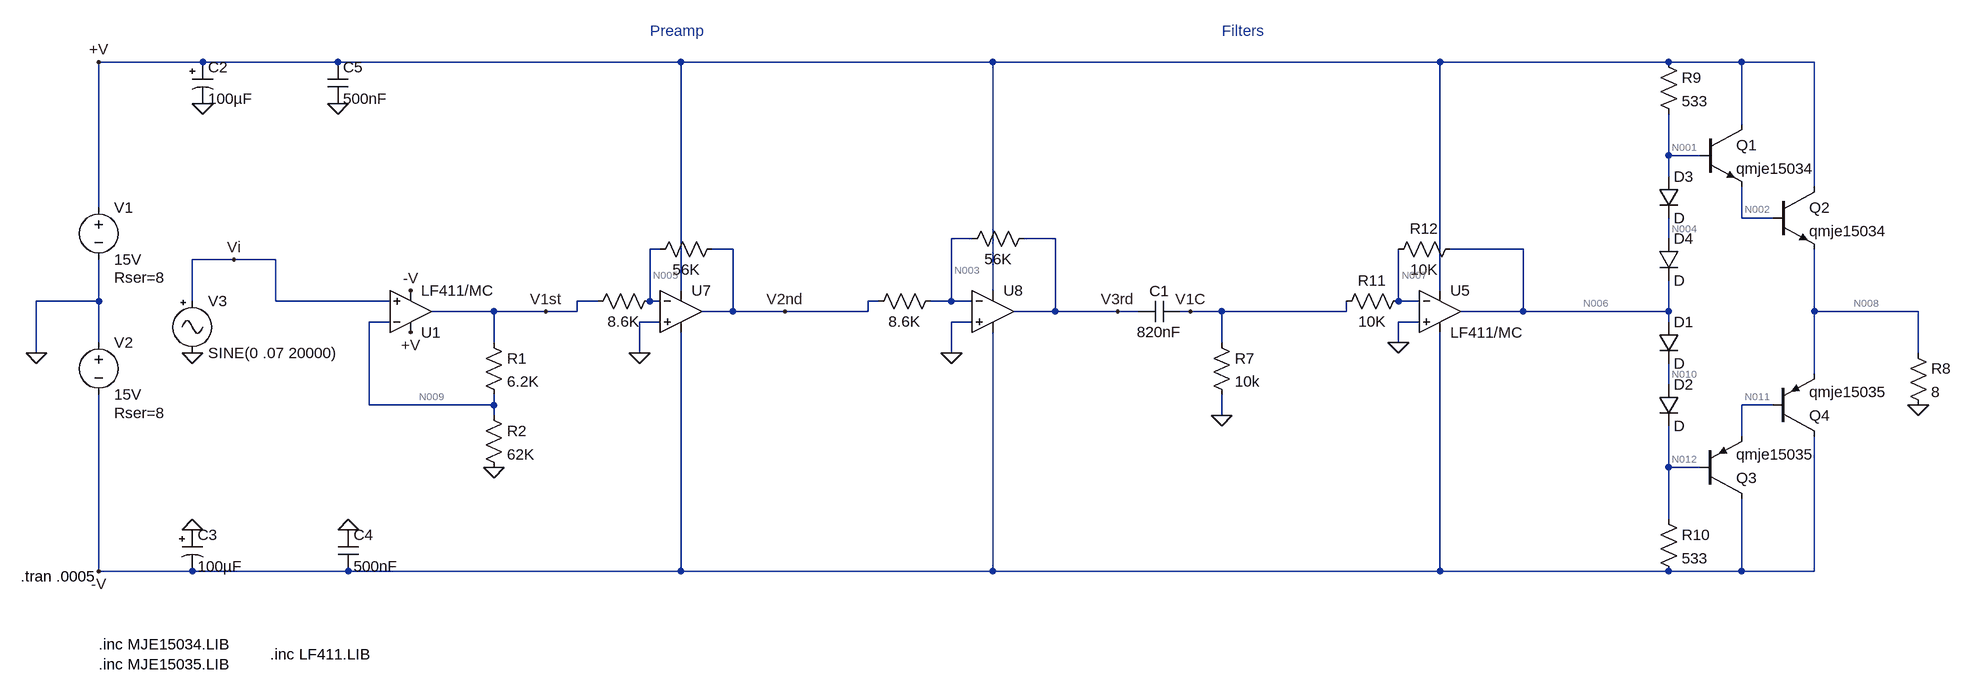
[diagram p0: schematic circuit.asc]
circuit.asc, the LTspice schematic file:
Version 4
SHEET 1 3868 1556
WIRE 160 -128 0 -128
WIRE 368 -128 160 -128
WIRE 896 -128 368 -128
WIRE 1376 -128 896 -128
WIRE 2064 -128 1376 -128
WIRE 2416 -128 2064 -128
WIRE 2528 -128 2416 -128
WIRE 2640 -128 2528 -128
WIRE 2528 -32 2528 -128
WIRE 2416 16 2416 -48
WIRE 2464 16 2416 16
WIRE 2416 48 2416 16
WIRE 2640 64 2640 -128
WIRE 0 96 0 -128
WIRE 2528 112 2528 64
WIRE 2576 112 2528 112
WIRE 1344 144 1312 144
WIRE 1472 144 1424 144
WIRE 2416 144 2416 112
WIRE 864 160 848 160
WIRE 976 160 944 160
WIRE 2192 160 2080 160
WIRE 208 176 144 176
WIRE 272 176 208 176
WIRE 896 224 896 -128
WIRE 1376 224 1376 -128
WIRE 2064 224 2064 -128
WIRE 0 240 0 176
WIRE 0 240 -96 240
WIRE 144 240 144 176
WIRE 272 240 272 176
WIRE 448 240 272 240
WIRE 768 240 736 240
WIRE 848 240 848 160
WIRE 864 240 848 240
WIRE 1200 240 1184 240
WIRE 1312 240 1312 144
WIRE 1312 240 1280 240
WIRE 1344 240 1312 240
WIRE 2000 240 2000 160
WIRE 2032 240 2000 240
WIRE 608 256 512 256
WIRE 688 256 608 256
WIRE 736 256 736 240
WIRE 736 256 688 256
WIRE 976 256 976 160
WIRE 976 256 928 256
WIRE 1056 256 976 256
WIRE 1184 256 1184 240
WIRE 1184 256 1056 256
WIRE 1472 256 1472 144
WIRE 1472 256 1408 256
WIRE 1568 256 1472 256
WIRE 1600 256 1568 256
WIRE 1680 256 1664 256
WIRE 1728 256 1680 256
WIRE 1920 256 1920 240
WIRE 1920 256 1728 256
WIRE 2192 256 2192 160
WIRE 2192 256 2096 256
WIRE 2416 256 2416 208
WIRE 2416 256 2192 256
WIRE 2640 256 2640 160
WIRE 2800 256 2640 256
WIRE 448 272 416 272
WIRE 864 272 832 272
WIRE 1344 272 1312 272
WIRE 2032 272 2000 272
WIRE 2416 272 2416 256
WIRE 0 304 0 240
WIRE 608 304 608 256
WIRE 1728 304 1728 256
WIRE 2000 304 2000 272
WIRE -96 320 -96 240
WIRE 832 320 832 272
WIRE 1312 320 1312 272
WIRE 2800 320 2800 256
WIRE 2640 352 2640 256
WIRE 2416 368 2416 336
WIRE 416 400 416 272
WIRE 608 400 608 384
WIRE 608 400 416 400
WIRE 2576 400 2528 400
WIRE 608 416 608 400
WIRE 1728 416 1728 384
WIRE 2528 448 2528 400
WIRE 2416 496 2416 432
WIRE 2464 496 2416 496
WIRE 2416 576 2416 496
WIRE 0 656 0 384
WIRE 144 656 0 656
WIRE 384 656 144 656
WIRE 896 656 896 288
WIRE 896 656 384 656
WIRE 1376 656 1376 288
WIRE 1376 656 896 656
WIRE 2064 656 2064 288
WIRE 2064 656 1376 656
WIRE 2416 656 2064 656
WIRE 2528 656 2528 544
WIRE 2528 656 2416 656
WIRE 2640 656 2640 448
WIRE 2640 656 2528 656
FLAG -96 320 0
FLAG 144 320 0
FLAG 208 176 Vi
FLAG 688 256 V1st
FLAG 832 320 0
FLAG 1056 256 V2nd
FLAG 1312 320 0
FLAG 1568 256 V3rd
FLAG 1728 416 0
FLAG 1680 256 V1C
FLAG 0 -128 +V
FLAG 0 656 -V
FLAG 2000 304 0
FLAG 160 -64 0
FLAG 368 -64 0
FLAG 144 592 0
FLAG 384 592 0
FLAG 608 496 0
FLAG 480 288 +V
FLAG 480 224 -V
FLAG 2800 400 0
SYMBOL voltage 0 80 R0
WINDOW 123 0 0 Left 0
WINDOW 39 24 124 Left 2
SYMATTR SpiceLine Rser=8
SYMATTR InstName V1
SYMATTR Value 15V
SYMBOL voltage 0 288 R0
WINDOW 123 0 0 Left 0
WINDOW 39 24 124 Left 2
SYMATTR SpiceLine Rser=8
SYMATTR InstName V2
SYMATTR Value 15V
SYMBOL Misc\\signal 144 224 R0
WINDOW 123 0 0 Left 0
WINDOW 39 0 0 Left 0
SYMATTR InstName V3
SYMATTR Value SINE(0 .07 20000)
SYMBOL res 864 224 R90
WINDOW 0 0 56 Invisible 2
WINDOW 3 32 56 VTop 2
SYMATTR InstName R3
SYMATTR Value 8.6K
SYMATTR SpiceLine tol=5
SYMBOL res 960 144 R90
WINDOW 0 0 56 Invisible 2
WINDOW 3 32 56 VTop 2
SYMATTR InstName R4
SYMATTR Value 56K
SYMATTR SpiceLine tol=5
SYMBOL res 1440 128 R90
WINDOW 0 0 56 Invisible 2
WINDOW 3 32 56 VTop 2
SYMATTR InstName R5
SYMATTR Value 56K
SYMATTR SpiceLine tol=5
SYMBOL res 1296 224 R90
WINDOW 0 0 56 Invisible 2
WINDOW 3 32 56 VTop 2
SYMATTR InstName R6
SYMATTR Value 8.6K
SYMATTR SpiceLine tol=5
SYMBOL cap 1664 240 R90
WINDOW 0 0 32 VBottom 2
WINDOW 3 32 32 VTop 2
SYMATTR InstName C1
SYMATTR Value 820nF
SYMBOL res 1712 288 R0
SYMATTR InstName R7
SYMATTR Value 10k
SYMBOL res 2016 224 R90
WINDOW 0 0 56 VBottom 2
WINDOW 3 32 56 VTop 2
SYMATTR InstName R11
SYMATTR Value 10K
SYMBOL res 2096 144 R90
WINDOW 0 0 56 VBottom 2
WINDOW 3 32 56 VTop 2
SYMATTR InstName R12
SYMATTR Value 10K
SYMBOL polcap 144 -128 R0
WINDOW 3 24 56 Left 2
SYMATTR Value 100µF
SYMATTR InstName C2
SYMATTR Description Capacitor
SYMATTR Type cap
SYMATTR SpiceLine V=10 Irms=0 Rser=4 Lser=0
SYMBOL cap 352 -128 R0
SYMATTR InstName C5
SYMATTR Value 500nF
SYMBOL polcap 128 592 R0
WINDOW 3 24 56 Left 2
SYMATTR Value 100µF
SYMATTR InstName C3
SYMATTR Description Capacitor
SYMATTR Type cap
SYMATTR SpiceLine V=10 Irms=0 Rser=4 Lser=0
SYMBOL cap 368 592 R0
SYMATTR InstName C4
SYMATTR Value 500nF
SYMBOL Opamps\\UniversalOpamp2 896 256 R0
SYMATTR InstName U7
SYMBOL Opamps\\UniversalOpamp2 1376 256 R0
SYMATTR InstName U8
SYMBOL Opamps\\opamp2 2064 192 R0
SYMATTR InstName U5
SYMATTR Value LF411/MC
SYMBOL Opamps\\opamp2 480 320 M180
SYMATTR InstName U1
SYMATTR Value LF411/MC
SYMBOL res 592 288 R0
SYMATTR InstName R1
SYMATTR Value 6.2K
SYMBOL res 592 400 R0
SYMATTR InstName R2
SYMATTR Value 62K
SYMBOL npn 2464 -32 R0
SYMATTR InstName Q1
SYMATTR Value qmje15034
SYMBOL pnp 2464 544 M180
SYMATTR InstName Q3
SYMATTR Value qmje15035
SYMBOL res 2784 304 R0
SYMATTR InstName R8
SYMATTR Value 8
SYMBOL res 2400 -144 R0
SYMATTR InstName R9
SYMATTR Value 533
SYMBOL res 2400 560 R0
SYMATTR InstName R10
SYMATTR Value 533
SYMBOL diode 2400 272 R0
SYMATTR InstName D1
SYMBOL diode 2400 368 R0
SYMATTR InstName D2
SYMBOL diode 2400 48 R0
SYMATTR InstName D3
SYMBOL diode 2400 144 R0
SYMATTR InstName D4
SYMBOL npn 2576 64 R0
SYMATTR InstName Q2
SYMATTR Value qmje15034
SYMBOL pnp 2576 448 M180
SYMATTR InstName Q4
SYMATTR Value qmje15035
TEXT -120 664 Left 2 !.tran .0005
TEXT 848 -176 Left 2 ;Preamp
TEXT 1728 -176 Left 2 ;Filters
TEXT 0 768 Left 2 !.inc MJE15034.LIB\n.inc MJE15035.LIB
TEXT 264 784 Left 2 !.inc LF411.LIB

The netlist it stands for:
* circuit.asc
V1 +V 0 15V Rser=8
V2 0 -V 15V Rser=8
V3 Vi 0 SINE(0 .07 20000)
R3 N005 V1st 8.6K tol=5
R4 V2nd N005 56K tol=5
R5 V3rd N003 56K tol=5
R6 N003 V2nd 8.6K tol=5
C1 V1C V3rd 820nF
R7 V1C 0 10k
R11 N007 V1C 10K
R12 N006 N007 10K
C2 +V 0 100µF V=10 Irms=0 Rser=4 Lser=0
C5 +V 0 500nF
C3 0 -V 100µF V=10 Irms=0 Rser=4 Lser=0
C4 0 -V 500nF
XU7 0 N005 +V -V V2nd level.2 Avol=1Meg GBW=10Meg Slew=10Meg ilimit=25m rail=0 Vos=0 phimargin=45 en=0 enk=0 in=0 ink=0 Rin=500Meg  ; pins IN+ IN- V+ V- OUT
XU8 0 N003 +V -V V3rd level.2 Avol=1Meg GBW=10Meg Slew=10Meg ilimit=25m rail=0 Vos=0 phimargin=45 en=0 enk=0 in=0 ink=0 Rin=500Meg  ; pins IN+ IN- V+ V- OUT
XU5 0 N007 +V -V N006 LF411/MC  ; pins In+ In- V+ V- OUT
XU1 Vi N009 +V -V V1st LF411/MC  ; pins In+ In- V+ V- OUT
R1 V1st N009 6.2K
R2 N009 0 62K
Q1 +V N001 N002 0 qmje15034
Q3 -V N012 N011 0 qmje15035
R8 N008 0 8
R9 +V N001 533
R10 N012 -V 533
D1 N006 N010 D
D2 N010 N012 D
D3 N001 N004 D
D4 N004 N006 D
Q2 +V N002 N008 0 qmje15034
Q4 -V N011 N008 0 qmje15035
.model D D
.lib standard.dio
.model NPN NPN
.model PNP PNP
.lib standard.bjt
.tran .0005
* Preamp
* Filters
.inc MJE15034.LIB
.inc MJE15035.LIB
.inc LF411.LIB
.lib UniversalOpamps2.sub
.backanno
.end

* Results of the author's LTspice run, read from the files saved beside the schematic
* Operating Point, zero values left out:
*   V(+v) = 3.862 V
*   V(-v) = -3.87 V
*   V(n005) = -4.294 nV
*   V(v1st) = 12.7 µV
*   V(v2nd) = -82.27 µV
*   V(v3rd) = 536.2 µV
*   V(n003) = -4.916 nV
*   V(v1c) = 5.497 µV
*   V(n007) = 10.99 µV
*   V(n006) = 17.13 µV
*   V(n009) = 11.19 µV
*   V(n001) = 1.387 V
*   V(n002) = 779.1 mV
*   V(n012) = -1.389 V
*   V(n011) = -769.3 mV
*   V(n008) = 10.47 mV
*   V(n010) = -694.7 mV
*   V(n004) = 693.4 mV
*   Ic(Q4) = -1.374 A
*   Ib(Q4) = -10.74 mA
*   Ie(Q4) = 1.385 A
*   Ic(Q3) = -10.7 mA
*   Ib(Q3) = -39.18 µA
*   Ie(Q3) = 10.74 mA
*   Ic(Q2) = 1.349 A
*   Ib(Q2) = 36.69 mA
*   Ie(Q2) = -1.386 A
*   Ic(Q1) = 36.44 mA
*   Ib(Q1) = 246.6 µA
*   Ie(Q1) = -36.69 mA
*   I(D4) = 4.397 mA
*   I(D3) = 4.397 mA
*   I(D2) = 4.616 mA
*   I(D1) = 4.616 mA
*   I(R10) = 4.655 mA
*   I(R9) = 4.643 mA
*   I(R8) = 1.308 mA
*   I(R2) = 180.5 pA
*   I(R1) = 244.5 pA
*   I(R12) = 613.8 pA
*   I(R11) = 549.7 pA
*   I(R7) = 549.7 pA
*   I(R6) = 9.566 nA
*   I(R5) = 9.575 nA
*   I(R4) = -1.469 nA
*   I(R3) = -1.478 nA
*   I(V3) = -64.03 pA
*   I(V2) = -1.391 A
*   I(V1) = -1.392 A
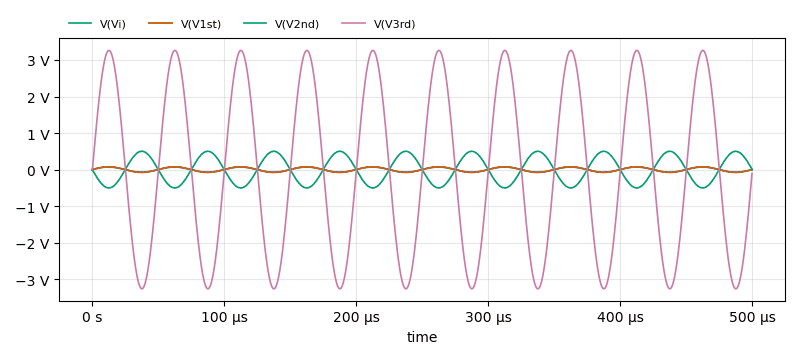
[diagram p1: Transient Analysis of circuit.asc, plotted from the saved traces]
* Transient Analysis, 1 run:
*   V(Vi): min -69.93 mV, max 69.93 mV, average 26.47 nV, rms 49.45 mV, last 0 V
*   V(V1st): min -76.93 mV, max 76.95 mV, average 12.84 µV, rms 54.41 mV, last -140.7 µV
*   V(V2nd): min -501.1 mV, max 500.9 mV, average -85.7 µV, rms 354.3 mV, last 8.569 mV
*   V(V3rd): min -3.261 V, max 3.262 V, average 583.8 µV, rms 2.306 V, last -105.4 mV